# Altium schematic sheet HU_SUPPORT_BOARD.SchDoc
size C; SheetNumber: 1; SheetTotal: 7
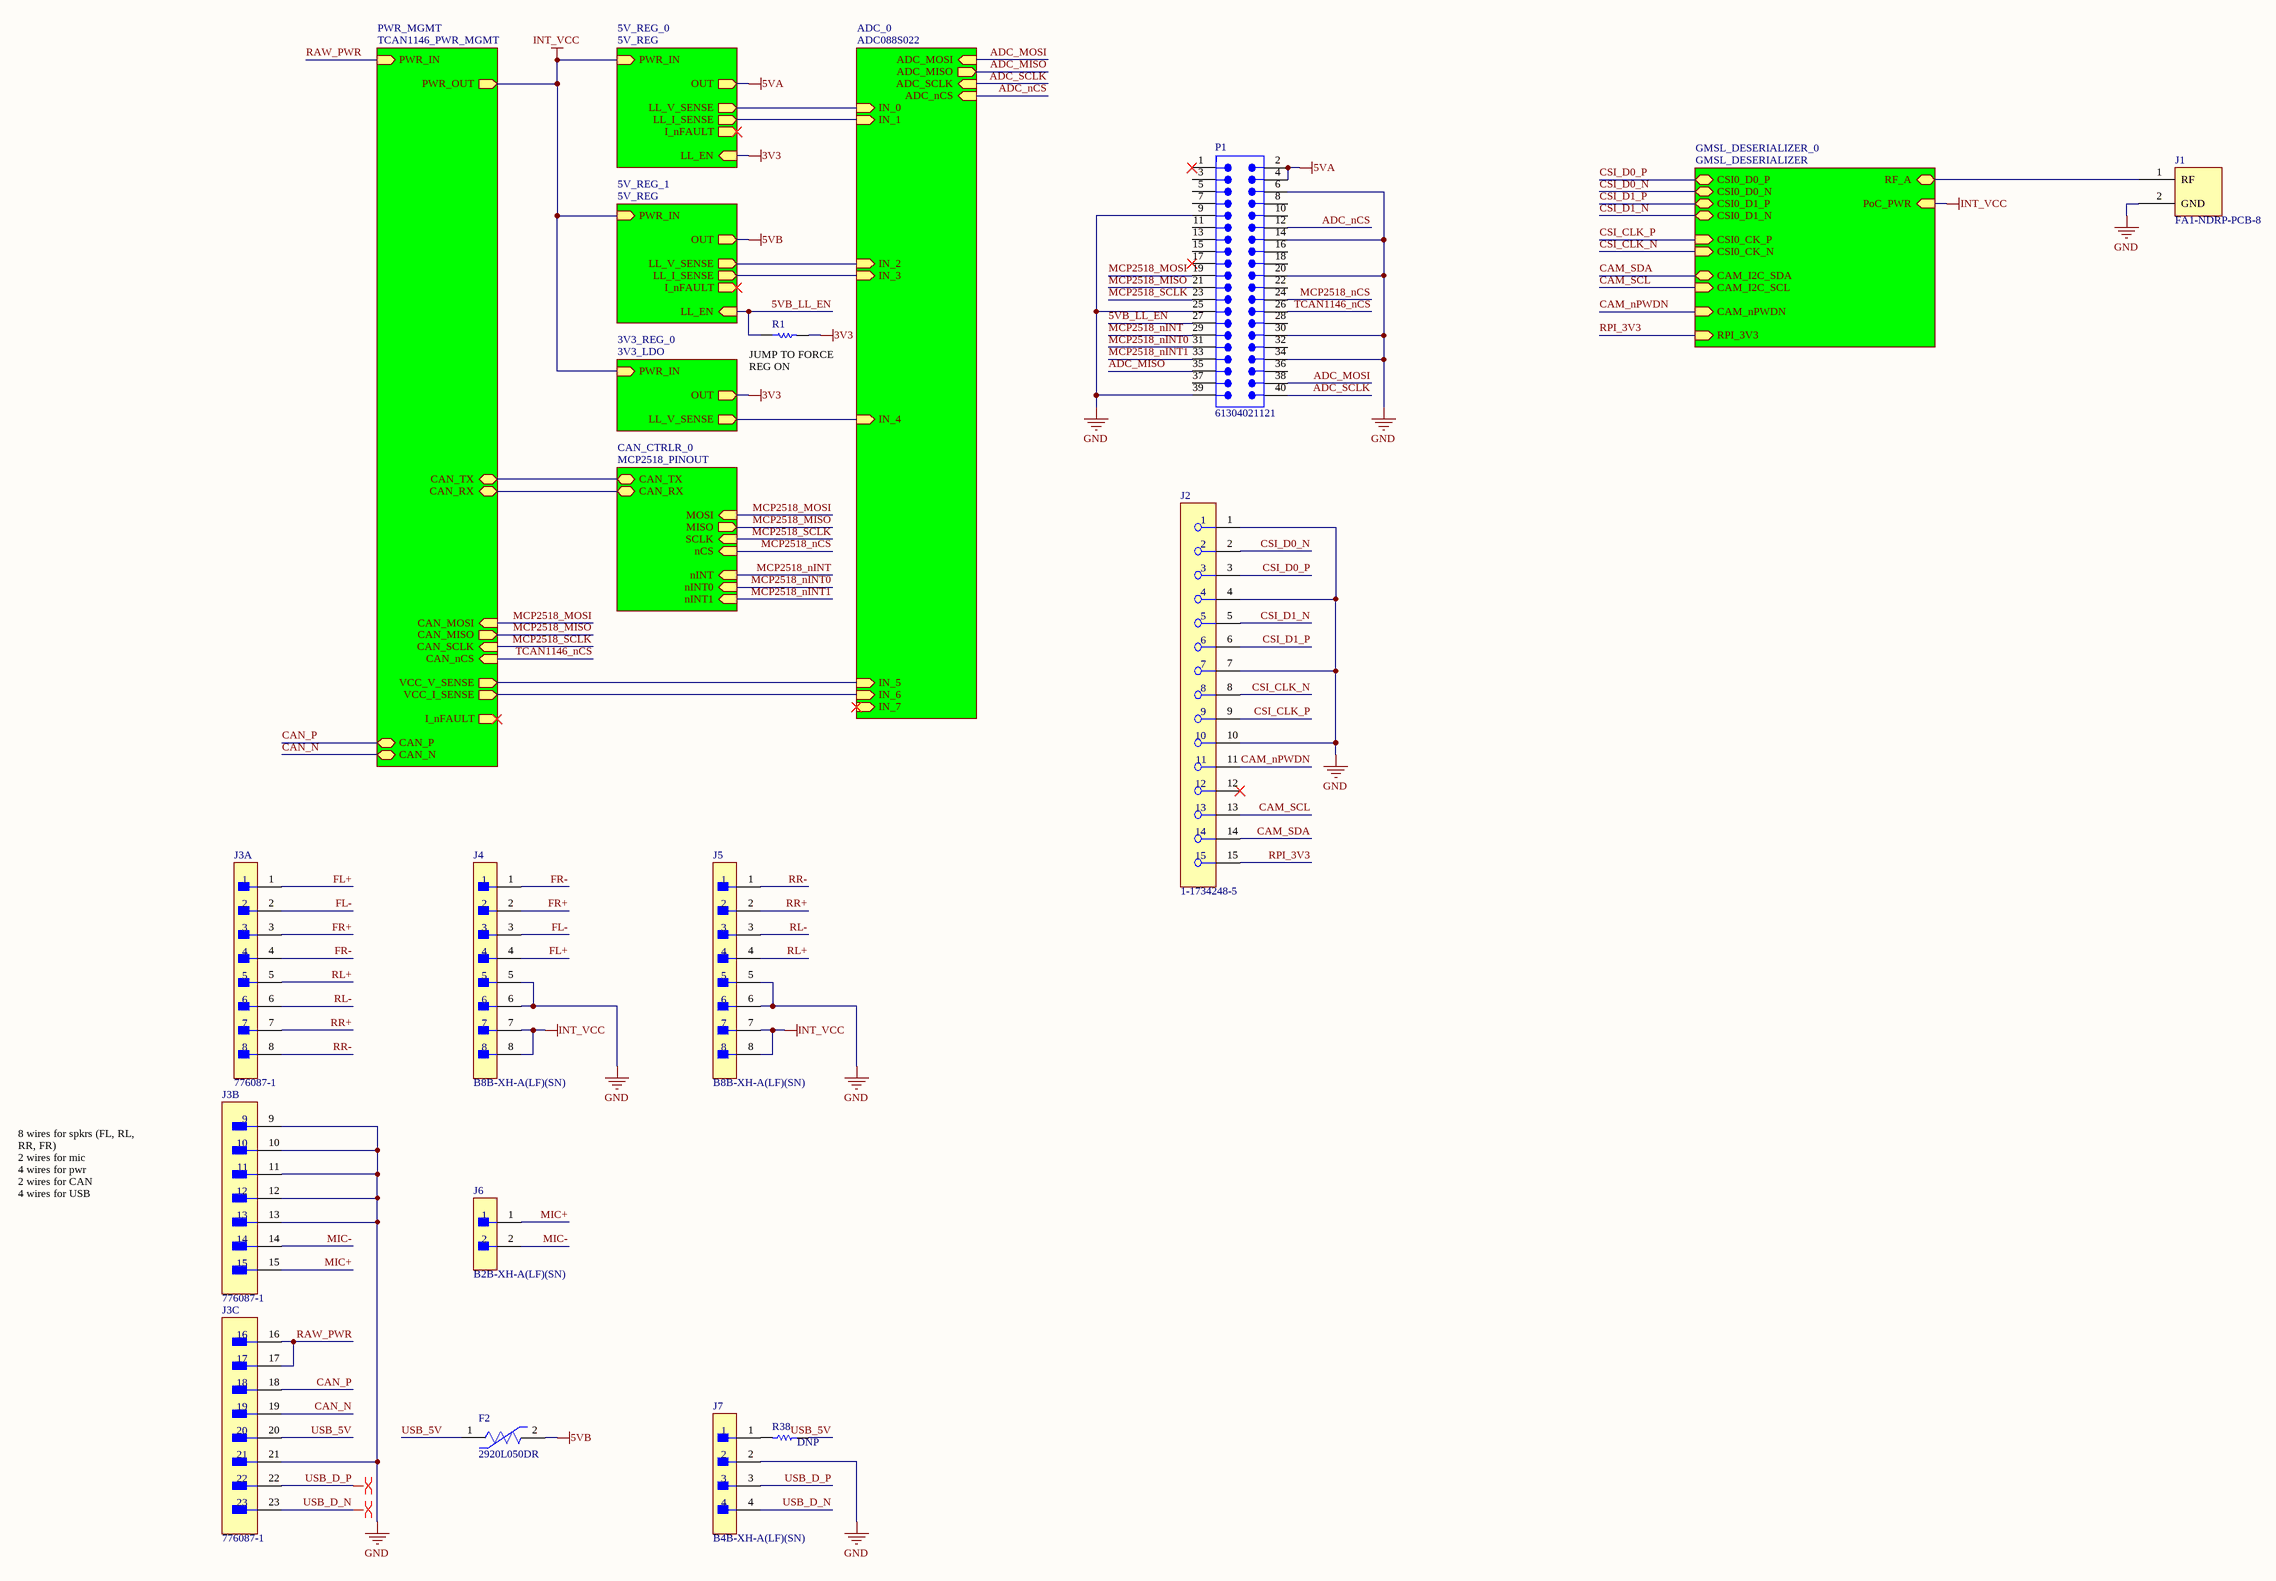
[diagram p0: HU_SUPPORT_BOARD.SchDoc]

## Parts
F2  2920L050DR  [FP-2920L050DR-MFG]
J1  FA1-NDRP-PCB-8  [FA1-NDRP-PCB-8-Footprint-1]
J2  1-1734248-5  [FP-1-1734248-5-MFG]
J3  776087-1  [FP-776087-1-MFG]  (parts A,B,C of 3)
J4  B8B-XH-A(LF)(SN)  [FP-B8B-XH-A_LF_SN-MFG]
J5  B8B-XH-A(LF)(SN)  [FP-B8B-XH-A_LF_SN-MFG]
J6  B2B-XH-A(LF)(SN)  [FP-B2B-XH-A_LF_SN-MFG]
J7  B4B-XH-A(LF)(SN)  [FP-B4B-XH-A_LF_SN-MFG]
P1  61304021121  [61304021121]
R1  DNP  [RESC1005X40X25ML05T05]  (value not drawn)
R38  DNP  [R0603B]

## Sub-sheets
3V3_REG_0 = 3V3_LDO: PWR_IN (in), OUT (out), LL_V_SENSE (out)
5V_REG_0 = 5V_REG: PWR_IN (in), LL_EN (in), OUT (out), LL_V_SENSE (out), LL_I_SENSE (out), I_nFAULT (out)
5V_REG_1 = 5V_REG: PWR_IN (in), LL_EN (in), OUT (out), LL_V_SENSE (out), LL_I_SENSE (out), I_nFAULT (out)
ADC_0 = ADC088S022: IN_0 (in), IN_1 (in), IN_2 (in), IN_3 (in), IN_4 (in), IN_5 (in), IN_6 (in), IN_7 (in), ADC_MOSI (in), ADC_MISO (out), ADC_SCLK (in), ADC_nCS (in)
CAN_CTRLR_0 = MCP2518_PINOUT: CAN_TX (bidir), CAN_RX (bidir), MOSI (in), MISO (out), SCLK (in), nCS (in), nINT (in), nINT0 (in), nINT1 (in)
GMSL_DESERIALIZER_0 = GMSL_DESERIALIZER: CSI0_D0_P (bidir), CSI0_D0_N (bidir), CSI0_D1_P (bidir), CSI0_D1_N (bidir), CSI0_CK_P (in), CSI0_CK_N (in), CAM_I2C_SDA (bidir), CAM_I2C_SCL (in), PoC_PWR (in), CAM_nPWDN (in), RF_A (bidir), RPI_3V3 (in)
PWR_MGMT = TCAN1146_PWR_MGMT: PWR_IN (in), PWR_OUT (out), CAN_TX (bidir), CAN_RX (bidir), CAN_SCLK (in), CAN_MISO (out), CAN_MOSI (in), CAN_nCS (in), VCC_V_SENSE (out), VCC_I_SENSE (out), I_nFAULT (out), CAN_P (bidir), CAN_N (bidir)

## Nets
3V3: R1.2 ; sheet 5V_REG_0/LL_EN, sheet 3V3_REG_0/OUT
5VA: P1.2 P1.4 ; sheet 5V_REG_0/OUT
5VB: F2.2 ; sheet 5V_REG_1/OUT
GND: J1.2(GND) J2.1 J2.4 J2.7 J2.10 J3.9 J3.10 J3.11 J3.12 J3.13 J3.21 J4.5 J4.6 J5.5 J5.6 J7.2 P1.6 P1.9 P1.14 P1.20 P1.25 P1.30 P1.34 P1.39
INT_VCC: J4.7 J4.8 J5.7 J5.8 ; sheet PWR_MGMT/PWR_OUT, sheet 5V_REG_0/PWR_IN, sheet 5V_REG_1/PWR_IN, sheet GMSL_DESERIALIZER_0/PoC_PWR, sheet 3V3_REG_0/PWR_IN
5VB_LL_EN: P1.27 R1.1 ; sheet 5V_REG_1/LL_EN
ADC_MISO: P1.35 ; sheet ADC_0/ADC_MISO
ADC_MOSI: P1.38 ; sheet ADC_0/ADC_MOSI
ADC_nCS: P1.12 ; sheet ADC_0/ADC_nCS
ADC_SCLK: P1.40 ; sheet ADC_0/ADC_SCLK
CAM_nPWDN: J2.11 ; sheet GMSL_DESERIALIZER_0/CAM_nPWDN
CAM_SCL: J2.13 ; sheet GMSL_DESERIALIZER_0/CAM_I2C_SCL
CAM_SDA: J2.14 ; sheet GMSL_DESERIALIZER_0/CAM_I2C_SDA
CAN_N: J3.19 ; sheet PWR_MGMT/CAN_N
CAN_P: J3.18 ; sheet PWR_MGMT/CAN_P
CSI_CLK_N: J2.8 ; sheet GMSL_DESERIALIZER_0/CSI0_CK_N
CSI_CLK_P: J2.9 ; sheet GMSL_DESERIALIZER_0/CSI0_CK_P
CSI_D0_N: J2.2 ; sheet GMSL_DESERIALIZER_0/CSI0_D0_N
CSI_D0_P: J2.3 ; sheet GMSL_DESERIALIZER_0/CSI0_D0_P
CSI_D1_N: J2.5 ; sheet GMSL_DESERIALIZER_0/CSI0_D1_N
CSI_D1_P: J2.6 ; sheet GMSL_DESERIALIZER_0/CSI0_D1_P
FL+: J3.1 J4.4
FL-: J3.2 J4.3
FR+: J3.3 J4.2
FR-: J3.4 J4.1
MCP2518_MISO: P1.21 ; sheet PWR_MGMT/CAN_MISO, sheet CAN_CTRLR_0/MISO
MCP2518_MOSI: P1.19 ; sheet PWR_MGMT/CAN_MOSI, sheet CAN_CTRLR_0/MOSI
MCP2518_nCS: P1.24 ; sheet CAN_CTRLR_0/nCS
MCP2518_nINT: P1.29 ; sheet CAN_CTRLR_0/nINT
MCP2518_nINT0: P1.31 ; sheet CAN_CTRLR_0/nINT0
MCP2518_nINT1: P1.33 ; sheet CAN_CTRLR_0/nINT1
MCP2518_SCLK: P1.23 ; sheet PWR_MGMT/CAN_SCLK, sheet CAN_CTRLR_0/SCLK
MIC+: J3.15 J6.1
MIC-: J3.14 J6.2
RAW_PWR: J3.16 J3.17 ; sheet PWR_MGMT/PWR_IN
RL+: J3.5 J5.4
RL-: J3.6 J5.3
RPI_3V3: J2.15 ; sheet GMSL_DESERIALIZER_0/RPI_3V3
RR+: J3.7 J5.2
RR-: J3.8 J5.1
TCAN1146_nCS: P1.26 ; sheet PWR_MGMT/CAN_nCS
USB_5V: F2.1 J3.20 R38.1
USB_D_N: J3.23 J7.4
USB_D_P: J3.22 J7.3
NetJ1_1: J1.1(RF) ; sheet GMSL_DESERIALIZER_0/RF_A
NetJ7_1: J7.1 R38.2
(unnamed): sheet PWR_MGMT/CAN_TX, sheet CAN_CTRLR_0/CAN_TX
(unnamed): sheet PWR_MGMT/CAN_RX, sheet CAN_CTRLR_0/CAN_RX
(unnamed): sheet PWR_MGMT/VCC_V_SENSE, sheet ADC_0/IN_5
(unnamed): sheet PWR_MGMT/VCC_I_SENSE, sheet ADC_0/IN_6
(unnamed): sheet 5V_REG_0/LL_V_SENSE, sheet ADC_0/IN_0
(unnamed): sheet 5V_REG_0/LL_I_SENSE, sheet ADC_0/IN_1
(unnamed): sheet 5V_REG_1/LL_V_SENSE, sheet ADC_0/IN_2
(unnamed): sheet 5V_REG_1/LL_I_SENSE, sheet ADC_0/IN_3
(unnamed): sheet ADC_0/IN_4, sheet 3V3_REG_0/LL_V_SENSE

Not connected (* = marked no-connect by the designer): J2 12*; P1 1* 3 5 7 8 10 11 13 15 16 17* 18 22 28 32 36 37

## Layout directives
differential pair: USB_D_N, USB_D_P

## Notes on the sheet
- (near R1) JUMP TO FORCE REG ON
- 8 wires for spkrs (FL, RL, RR, FR)
  2 wires for mic
  4 wires for pwr
  2 wires for CAN
  4 wires for USB

## Library data of the parts
F2 = CMP-08606-000071-1: PTC RESET FUSE 60V 500MA 2920; Resistance: 1.4R; Trip Current: 1A; Power Dissipation: 1.5W; Time to Trip: 4s; Approvals: cULus; Current Rating: 10A; Operating Supply Voltage: 60V; Termination: SMD/SMT; Width: 5.44mm; Case/Package: 2920; Series: 2920L; Case Code (Imperial): 2920; Height: 1.25mm; Hold Current: 500mA; Terminal Material: Copper; Min Operating Temperature: -40°C; Package Quantity: 1500; Max Voltage Rating (DC): 60V; RoHS Compliant: Yes; Case Code (Metric): 7351; Lead Free: Lead Free; Max Operating Temperature: 85°C; Voltage Rating (DC): 60V; Working Voltage: 60V; Length: 7.98mm; REACH SVHC: No SVHC; Max Current Rating: 10A; Voltage Rating: 60V; Packaging: Tape and Reel
J1 = CMP-002-00054-1: RF F Connector, Male, Board Mount, Solder Terminal, Plug; Connector Type: RF F CONNECTOR; RoHS Compliant: Yes; Mounting Technology: Board
J2 = CMP-03368-000001-1: CONN FPC VERT 15POS 1.00MM SMD; Manufacturer: TE; Conn Orientation: Vertical; Conn Gender: Female; Current Rating: 1A; Is Female: yes; Number Of Contacts: 15; Pitch: 1mm; Voltage Rating: 125V; ComponentLink2URL: https://www.te.com/commerce/DocumentDelivery/DDEController?Action=showdoc&DocId=Customer+Drawing%7F1734248%7FE1%7Fpdf%7FEnglish%7FENG_CD_1734248_E1__.pdf%7F1-1734248-5; Device Class L1: Connectors; Category: Conn; Package: 0; Lead Free: Yes; Digikey Description: CONN FPC VERT 15POS 1.00MM SMD; Height: 8mm; Manufacturer Part Number: 1-1734248-5; Temperature: -20°C to +85°C; Contact Material: Gold,Nickel; Device Class L3: unset; ComponentLink2Description: Datasheet; RoHS: TRUE; Temperature Range Low: -20°C; Octopart: https://octopart.com/1-1734248-5-te+connectivity-40620898; Device Class L2: FFC / FPC; Mouser Description: FFC & FPC Connectors 15P 1.0 FPC, Zip V/T SMT; Automotive: No; Temperature Range High: +85°C; Mounting Type: Surface Mount
J3 = CMP-03369-000157-2: CONN HEADER R/A 23POS 4MM; Max Voltage Rating (AC): 250V; PCB Thickness: 0.062inch; PCB Mount Alignment: Yes (With); Primary Type: Rectangular; Number of Signal Positions: 23; Row Spacing: 0.157inch; Current Rating: 17A; Connector System: Wire-to-Device; Number of Ports: 1; Shielding: Unshielded; PCB Mount Retention: With; Circuit Application: Power; Tab Thickness: 1.3mm; Gender: Male; Contact Shape: Circular; Mount: Through Hole; ELV: Compliant; Orientation: Right Angle; Lead Free: Lead Free; Contact Plating: Tin; Package Quantity: 1; RoHS Compliant: Yes; Connector Type: Header; Series: Ampseal; Termination: Solder; Voltage Rating (AC): 250V; Contact Material: Brass; Number of Rows: 3; Depth: 37.9mm; Housing Material: Polybutylene; Fastening Type: Ramp; Width: 37.9mm; Flammability Rating: UL94 V-0; Housing Color: Black; Radiation Hardening: No; Contact Type: Male Pin; Sealable: Yes (With); Length: 60.8mm; Max Operating Temperature: 221°C; Packaging: Bulk; Number of Positions: 23; Insulation Material: PBT; Pitch: 0.157inch; Contact Finish - Mating: TIN; Color: Black; Number of Terminals/Pins: 23; Insulation Color: Black; Number of Contacts: 23; Min Operating Temperature: -40°C
J4 J5 = CMP-17438-000015-1: CONN HEADER VERT 8POS 2.5MM; Voltage Rating (AC): 250V; Insulation Resistance: 1GR; Connector Type: Male Pin; Max Current Rating: 3A; Wire/Cable Gauge: 22AWG; Number of Contacts: 8; Contact Resistance: 20mR; Orientation: Straight; Pitch: 2.5mm; Min Operating Temperature: -25°C; Number of Rows: 1; Contact Type: Male Pin; Packaging: Bulk; Lead Free: Lead Free; Max Operating Temperature: 85°C; Housing Material: Polyamide; Voltage Rating: 250V; Series: XH; Mount: Through Hole; Depth: 5.75mm; Contact Material: Brass; Fastening Type: Detent; Color: Natural; Max Voltage Rating (AC): 250V; Number of Positions: 8; Housing Color: White; Contact Plating: Tin; Lead Pitch: 2.5mm; Length: 22.4mm; REACH SVHC: No SVHC; Termination: Press-Fit; Current Rating: 3A
J6 = CMP-2000-05888-3: CONN HEADER VERT 2POS 2.5MM; Current Rating: 3A; Voltage Rating: 250V; Number of Contacts: 2; Contact Resistance: 20mR; Wire/Cable Gauge: 22AWG; Insulation Resistance: 1GR; Connector Type: Male Pin; Packaging: Bulk; Contact Material: Brass; Lead Free: Lead Free; Orientation: Straight; Contact Plating: Tin; Max Current Rating: 3A; Termination: Solder; Fastening Type: Detent; Depth: 5.75mm; Housing Material: Polyamide; REACH SVHC: No SVHC; Series: XH; Voltage Rating (AC): 250V; Number of Positions: 2; Color: Natural; Contact Type: Male Pin; Max Voltage Rating (DC): 250V; Pitch: 2.5mm; Lead Pitch: 2.5mm; Mount: Through Hole; Max Operating Temperature: 85°C; Length: 7.4mm; Max Voltage Rating (AC): 250V; Min Operating Temperature: -25°C; Number of Rows: 1; Housing Color: White
J7 = CMP-17439-000250-1: CONN HEADER VERT 4POS 2.5MM; Number of Contacts: 4; Contact Resistance: 20mR; Voltage Rating: 250V; Max Current Rating: 3A; Gender: Male; Wire/Cable Gauge: 22AWG; Mated Stacking Heights: 9.8mm; Insulation Resistance: 1GR; Orientation: Straight; Contact Type: Male Pin; Contact Finish - Mating: TIN; Series: XH; Max Voltage Rating (AC): 250V; Lead Pitch: 2.5mm; Contact Shape: Square; Insulation Color: Natural; Termination: Solder; Lead Free: Lead Free; Voltage Rating (AC): 250V; Number of Rows: 1; Flammability Rating: UL94 V-0; Number of Positions: 4; Max Operating Temperature: 85°C; Package Quantity: 500; Mount: Through Hole; REACH SVHC: No SVHC; Connector Type: Header; Insulation Material: Nylon; Fastening Type: Detent; Min Operating Temperature: -25°C; Housing Color: White; Packaging: Bulk; Contact Plating: Tin; Contact Material: Brass; Max Voltage Rating (DC): 250V; Housing Material: Polyamide; Color: Natural; Material: Polyamide; Pitch: 2.5mm; Depth: 5.75mm; Current Rating: 3A; Length: 12.4mm
P1 = CMP-1502-01135-3: NexarPartId: 32855579; Pitch: 2.54mm; Operating Supply Voltage: 250V; Gender: Male; Number of Positions: 40; Current Rating: 3A; Contact Resistance: 20mΩ; Connector Type: Male Pin; Color: Black; Contact Plating: Gold; Contact Material: Copper; Number of Rows: 2; Row Spacing: 2.54mm; Mount: Through Hole; RoHS: Compliant; Contact Mating Length: 5.9944mm; Voltage Rating: 250V; Orientation: Vertical; Max Operating Temperature: 105°C; REACH SVHC: Unknown; Min Operating Temperature: -40°C; Lead Pitch: 2.54mm; Height: 8.89mm; Termination: Solder; Number of Pins: 40; Number of Contacts: 40; Packaging: Bulk
R1 = CMP-009-00118-2: READ THE NAME; Pins: 2; Component Type: Standard; Design Item ID: CMP-009-00206-2; Source: 0402jump.SchLib
R38 = CMP-009-00002-14: Resistor; Value: DNP